# Altium schematic sheet sheet1.SchDoc
size A4
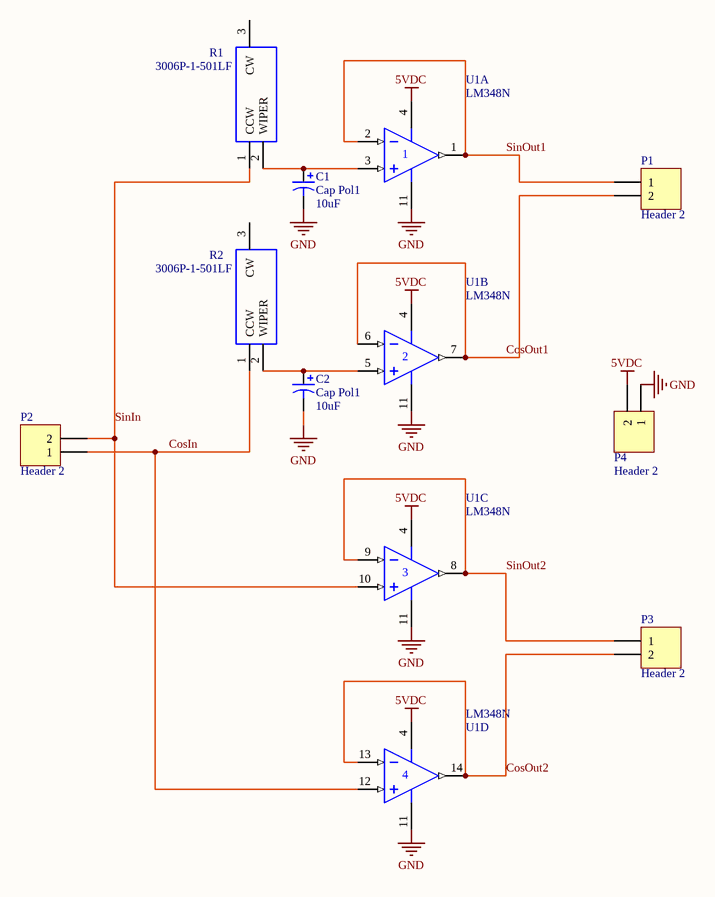
[diagram p0: sheet1.SchDoc]

## Parts
C1  Cap Pol1  value 10uF  [AXIAL-0.4]
C2  Cap Pol1  value 10uF  [AXIAL-0.4]
P1  Header 2  [HDR1X2]
P2  Header 2  [HDR1X2]
P3  Header 2  [HDR1X2]
P4  Header 2  [HDR1X2]
R1  3006P-1-501LF  [3006P_1]
R2  3006P-1-501LF  [3006P_1]
U1  LM348N  [646-06]  (parts A,B,C,D of 4)

## Nets
5VDC: P4.2 U1.4(V+)
GND: C1.2 C2.2 P4.1 U1.11(V-)
CosIn: P2.1 R2.1(CCW) U1.12(IN+)
CosOut1: P1.2 U1.6(IN-) U1.7(OUT)
CosOut2: P3.2 U1.13(IN-) U1.14(OUT)
SinIn: P2.2 R1.1(CCW) U1.10(IN+)
SinOut1: P1.1 U1.1(OUT) U1.2(IN-)
SinOut2: P3.1 U1.8(OUT) U1.9(IN-)
NetC1_1: C1.1 R1.2(WIPER) U1.3(IN+)
NetC2_1: C2.1 R2.2(WIPER) U1.5(IN+)

Not connected (* = marked no-connect by the designer): R1 3(CW); R2 3(CW)

## Library data of the parts
C1 C2 = Cap Pol1: Polarized Capacitor (Radial); Published: 8-Jun-2000; LatestRevisionDate: 17-Jul-2002; LatestRevisionNote: Re-released for DXP Platform.; PackageReference: RB7.6-15; Publisher: Altium Limited; PackageDescription: Polarized Capacitor (Radial); 2 Leads
P1-P4 = Header 2: Header, 2-Pin; LatestRevisionDate: 17-Jul-2002; LatestRevisionNote: Re-released for DXP Platform.; Publisher: Altium Limited
R1 R2 = 3006P-1-501LF: BOURNS - 3006P-1-501LF - TRIMMER, 15 TURN 500R; Allied_Number: 70153562; Manufacturer_Name: Bourns; Manufacturer_Part_Number: 3006P-1-501LF; RS Part Number: 5219120; RS Price/Stock: http://uk.rs-online.com/web/p/products/5219120; Allied Price/Stock: https://www.alliedelec.com/bourns-3006p-1-501lf/70153562/; Mouser Part Number: 652-3006P-1-501-LF; Mouser Price/Stock: https://www.mouser.com/Search/Refine.aspx?Keyword=652-3006P-1-501-LF; Datasheet Link: https://www.bourns.com/docs/Product-Datasheets/3006.pdf
U1 = LM348N: Quad General-Purpose Operational Amplifier; Published: 17-Jul-2002; LatestRevisionDate: 06-Jun-2005; LatestRevisionNote: Stylized 3D Model Added.; DatasheetVersion: 1988; PackageVersion: 1997; PackageReference: 646-06; Publisher: Altium Limited; PackageDescription: DIP; 14 Leads; Row Spacing 7.62 mm; Pitch 2.54 mm; ComponentLink1Description: Manufacturer Link; ComponentLink1URL: http://www.onsemi.com/site/products/parametrics/0,4446,251,00.html